# EAGLE design schematic (EAGLE 5.11)
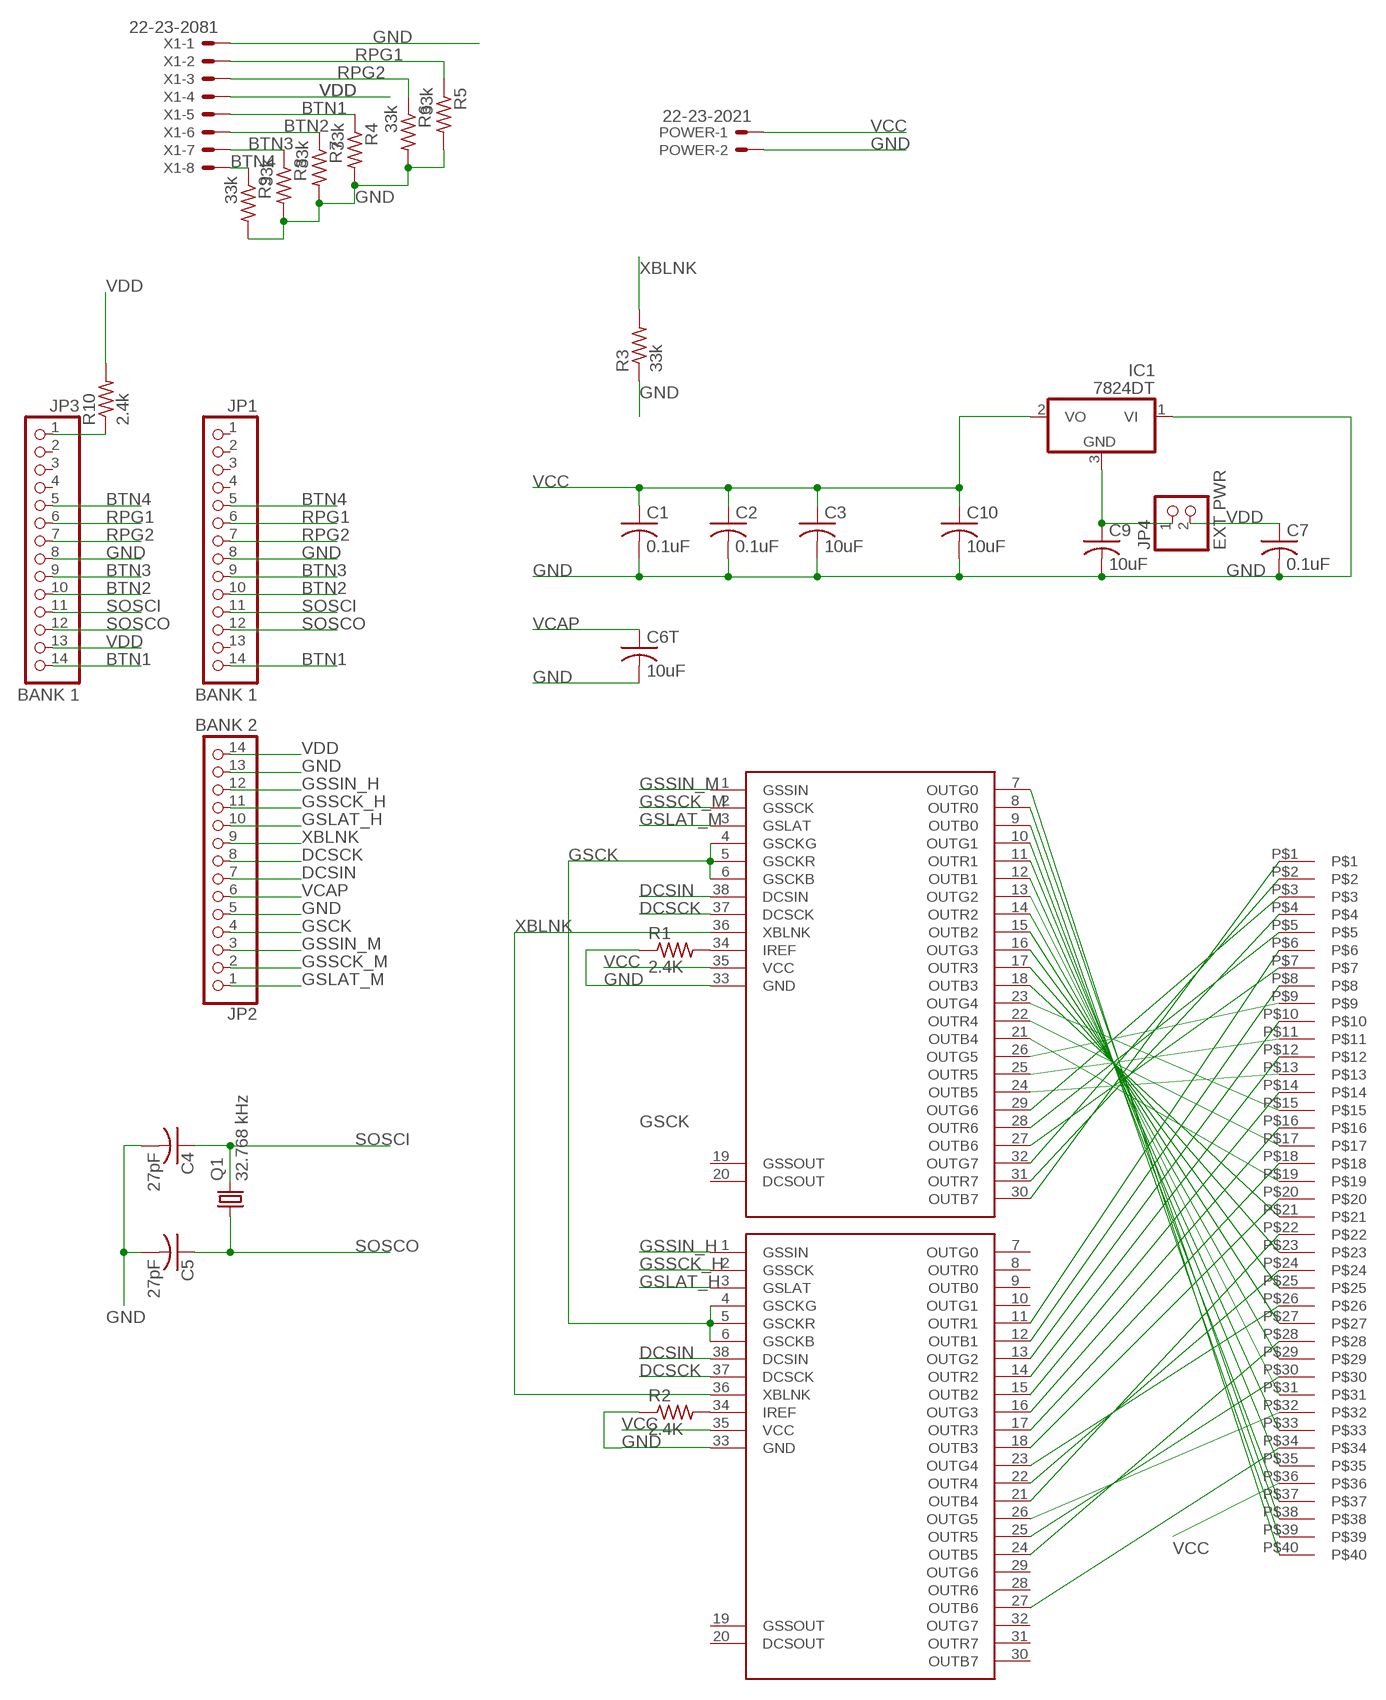
[diagram p0: schematic, sheet 1]

## Parts
C1  0.1uF  C-USC1206  [C1206]
C2  0.1uF  C-USC1206  [C1206]
C3  10uF  C-USC1206  [C1206]
C4  27pF  C-USC1206  [C1206]
C5  27pF  C-USC1206  [C1206]
C6T  10uF  C-USC1206  [C1206]
C7  0.1uF  C-USC1206  [C1206]
C9  10uF  C-USC1206  [C1206]
C10  10uF  C-USC1206  [C1206]
HOURS  TLC5951  [HTSSOP38DAP]
IC1  7824DT  [TO252]
JP1  BANK 1  PINHD-1X14  [1X14]
JP2  BANK 2  PINHD-1X14  [1X14]
JP3  BANK 1  PINHD-1X14  [1X14]
JP4  EXT PWR  PINHD-1X2  [1X02]
MINUTES  TLC5951  [HTSSOP38DAP]
POWER  22-23-2021  [22-23-2021]
Q1  32.768 kHz  CRYSTALTC26V  [TC26V]
R1  2.4K  R-US_R1206  [R1206]
R2  2.4K  R-US_R1206  [R1206]
R3  33k  R-US_R1206  [R1206]
R4  33k  R-US_R1206  [R1206]
R5  33k  R-US_R1206  [R1206]
R6  33k  R-US_R1206  [R1206]
R7  33k  R-US_R1206  [R1206]
R8  33k  R-US_R1206  [R1206]
R9  33k  R-US_R1206  [R1206]
R10  2.4k  R-US_R1206  [R1206]
U$3  501931-40  [501931-40]
X1  22-23-2081  [22-23-2081]

## Nets
BTN1: JP1.14 JP3.14 R4.1 X1.5
BTN2: JP1.10 JP3.10 R7.1 X1.6
BTN3: JP1.9 JP3.9 R8.1 X1.7
BTN4: JP1.5 JP3.5 R9.1 X1.8
DCSCK: HOURS.37(DCSCK) JP2.8 MINUTES.37(DCSCK)
DCSIN: HOURS.38(DCSIN) JP2.7 MINUTES.38(DCSIN)
GND: C1.2 C2.2 C3.2 C4.2 C5.2 C6T.2 C7.2 C9.2 C10.2 HOURS.33(GND) IC1.1(VI) JP1.8 JP2.5 JP2.13 JP3.8 MINUTES.33(GND) POWER.2 R1.1 R2.1 R3.1 R4.2 R5.2 R6.2 R7.2 R8.2 R9.2 X1.1
GSCK: HOURS.4(GSCKG) HOURS.5(GSCKR) HOURS.6(GSCKB) JP2.4 MINUTES.4(GSCKG) MINUTES.5(GSCKR) MINUTES.6(GSCKB)
GSLAT_H: HOURS.3(GSLAT) JP2.10
GSLAT_M: JP2.1 MINUTES.3(GSLAT)
GSSCK_H: HOURS.2(GSSCK) JP2.11
GSSCK_M: JP2.2 MINUTES.2(GSSCK)
GSSIN_H: HOURS.1(GSSIN) JP2.12
GSSIN_M: JP2.3 MINUTES.1(GSSIN)
N$1: MINUTES.32(OUTG7) U$3.P$2
N$2: MINUTES.31(OUTR7) U$3.P$4
N$3: MINUTES.30(OUTB7) U$3.P$1
N$4: MINUTES.29(OUTG6) U$3.P$3
N$5: MINUTES.28(OUTR6) U$3.P$5
N$6: MINUTES.27(OUTB6) U$3.P$7
N$7: MINUTES.26(OUTG5) U$3.P$9
N$8: MINUTES.25(OUTR5) U$3.P$11
N$9: MINUTES.24(OUTB5) U$3.P$13
N$10: MINUTES.23(OUTG4) U$3.P$15
N$11: MINUTES.22(OUTR4) U$3.P$17
N$12: MINUTES.21(OUTB4) U$3.P$19
N$13: MINUTES.18(OUTB3) U$3.P$21
N$14: MINUTES.17(OUTR3) U$3.P$23
N$15: MINUTES.16(OUTG3) U$3.P$25
N$16: MINUTES.15(OUTB2) U$3.P$27
N$17: MINUTES.14(OUTR2) U$3.P$29
N$18: MINUTES.13(OUTG2) U$3.P$31
N$19: MINUTES.12(OUTB1) U$3.P$33
N$20: MINUTES.11(OUTR1) U$3.P$35
N$21: MINUTES.10(OUTG1) U$3.P$37
N$22: MINUTES.9(OUTB0) U$3.P$39
N$23: MINUTES.7(OUTG0) U$3.P$40
N$24: MINUTES.8(OUTR0) U$3.P$38
N$25: HOURS.11(OUTR1) U$3.P$6
N$26: HOURS.12(OUTB1) U$3.P$8
N$27: HOURS.13(OUTG2) U$3.P$10
N$28: HOURS.14(OUTR2) U$3.P$12
N$29: HOURS.15(OUTB2) U$3.P$14
N$30: HOURS.16(OUTG3) U$3.P$16
N$31: HOURS.17(OUTR3) U$3.P$18
N$32: HOURS.18(OUTB3) U$3.P$20
N$33: HOURS.21(OUTB4) U$3.P$22
N$34: HOURS.22(OUTR4) U$3.P$24
N$35: HOURS.23(OUTG4) U$3.P$26
N$36: HOURS.26(OUTG5) U$3.P$32
N$37: HOURS.25(OUTR5) U$3.P$30
N$38: HOURS.24(OUTB5) U$3.P$28
N$39: HOURS.27(OUTB6) U$3.P$34
N$40: C9.1 IC1.3(GND) JP4.1
N$41: JP3.1 R10.1
N$42: MINUTES.34(IREF) R1.2
N$43: HOURS.34(IREF) R2.2
RPG1: JP1.6 JP3.6 R5.1 X1.2
RPG2: JP1.7 JP3.7 R6.1 X1.3
SOSCI: C4.1 JP1.11 JP3.11 Q1.2
SOSCO: C5.1 JP1.12 JP3.12 Q1.1
VCAP: C6T.1 JP2.6
VCC: C1.1 C2.1 C3.1 C10.1 HOURS.35(VCC) IC1.2(VO) MINUTES.35(VCC) POWER.1 U$3.P$36
VDD: C7.1 JP2.14 JP3.13 JP4.2 R10.2 X1.4
XBLNK: HOURS.36(XBLNK) JP2.9 MINUTES.36(XBLNK) R3.2
Unconnected: HOURS.7(OUTG0) HOURS.8(OUTR0) HOURS.9(OUTB0) HOURS.10(OUTG1) HOURS.19(GSSOUT) HOURS.20(DCSOUT) HOURS.28(OUTR6) HOURS.29(OUTG6) HOURS.30(OUTB7) HOURS.31(OUTR7) HOURS.32(OUTG7) JP1.1 JP1.2 JP1.3 JP1.4 JP1.13 JP3.2 JP3.3 JP3.4 MINUTES.19(GSSOUT) MINUTES.20(DCSOUT)

## Library data of the parts
C1-C5 C6T C7 C9 C10 = rcl:C-US: CAPACITOR, American symbol
HOURS MINUTES = texas:TLC5951: 24 Channel LED Driver 40 mA per channel
IC1 = linear:78*: Positive VOLTAGE REGULATOR Source: http://cache.national.com/ds/LM/LM78L05.pdf http://www.fairchildsemi.com/ds/LM/LM7805.pdf
JP1-JP3 = pinhead:PINHD-1X14: PIN HEADER
JP4 = pinhead:PINHD-1X2: PIN HEADER
POWER = con-molex:22-23-2021: .100" (2.54mm) Center Header - 2 Pin; MF: MOLEX; MPN: 22-23-2021; OC_FARNELL: 1462926; OC_NEWARK: 25C3832
Q1 = crystal:CRYSTAL: CRYSTAL; OC_FARNELL: unknown; OC_NEWARK: unknown
R1 R2 = resistor:R-US_: RESISTOR, American symbol
R3-R10 = rcl:R-US_: RESISTOR, American symbol
U$3 = con-molex:501931-40: Molex 40 pin connector Type 501931
X1 = con-molex:22-23-2081: .100" (2.54mm) Center Header - 8 Pin; MF: MOLEX; MPN: 22-23-2081; OC_FARNELL: 1756826; OC_NEWARK: 01C7592

## Board
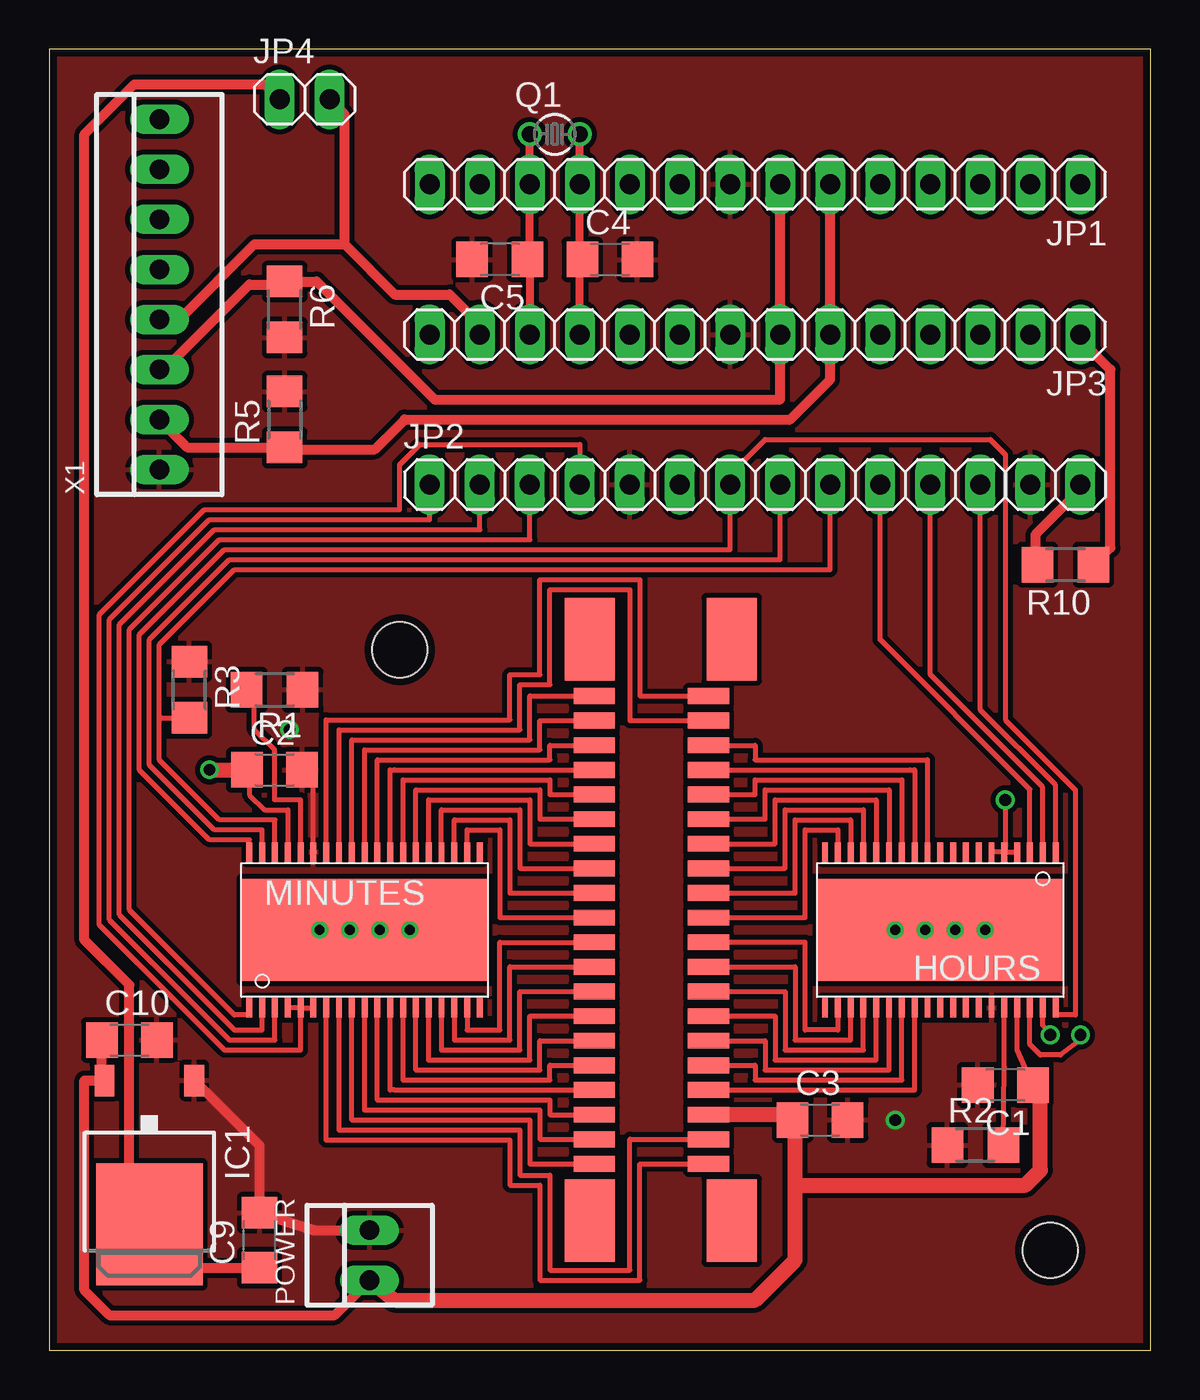
[diagram p1: board, top side]
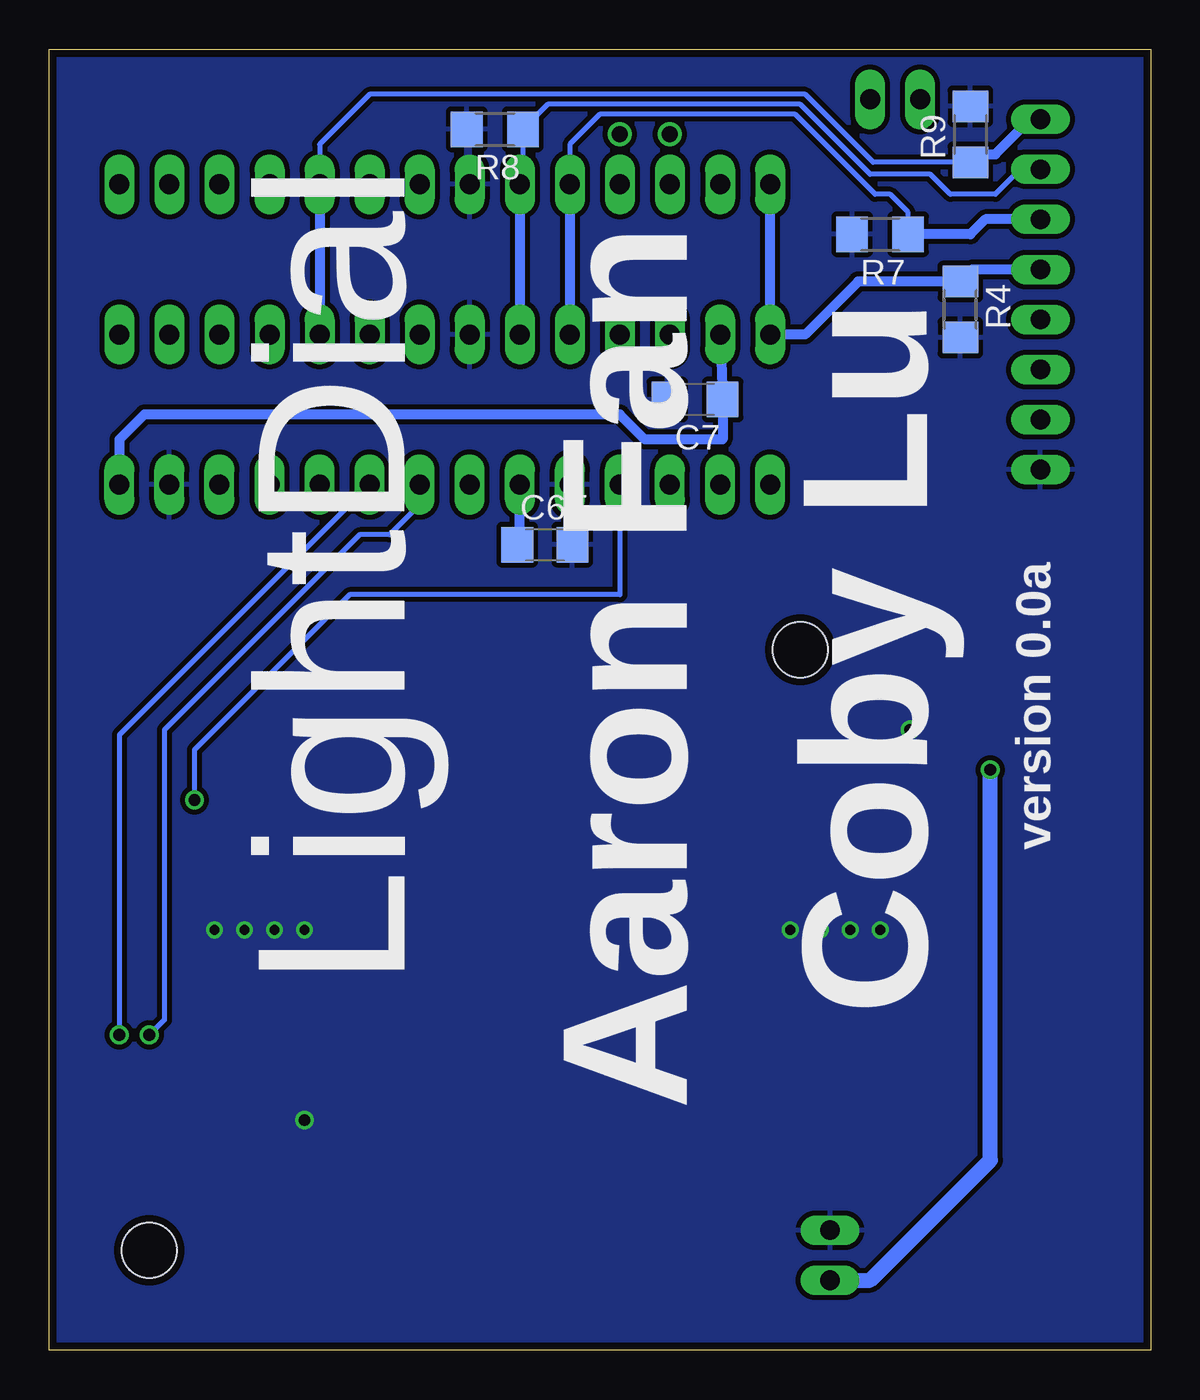
[diagram p2: board, bottom side, seen from below]

Size 55.88 x 66.04 mm. Coordinates in mm from the lower left corner, seen from the top.
Outline: 0,0 55.88,0 55.88,66.04 0,66.04 0,0
Copper layers (1*16): Top 0.0356mm / dielectric 1.5011mm / Bottom 0.0356mm
Design rules "LaenPCBOrder *": minimum track width 10mil, minimum drill 13mil, track to track 10mil, track to pad 10mil, pad to pad 10mil, via to via 10mil, smd to smd 10mil, copper to edge 15mil, drill to drill 10mil, minimum pad ring 7mil, minimum via ring 7mil, stop-mask expansion 4mil, vias tented up to drill 0mil, thermal gap 10mil
Holes 2.8 mm at 50.8,5.08 17.78,35.56

### Footprints (pad centres in the part's own frame; a part is rotated, then mirrored left to right if it is on the bottom)
C1206 = smd 1.6 x 1.8: 1 -1.4,0; 2 1.4,0
HTSSOP38DAP = smd 0.3 x 1: 1 -5.85,-3.95; 2 -5.2,-3.95; 3 -4.55,-3.95; 4 -3.9,-3.95; 5 -3.25,-3.95; 6 -2.6,-3.95; 7 -1.95,-3.95; 8 -1.3,-3.95; 9 -0.65,-3.95; 10 0,-3.95; 11 0.65,-3.95; 12 1.3,-3.95; 13 1.95,-3.95; 14 2.6,-3.95; 15 3.25,-3.95; 16 3.9,-3.95; 17 4.55,-3.95; 18 5.2,-3.95; 19 5.85,-3.95; 20 5.85,3.95; 21 5.2,3.95; 22 4.55,3.95; 23 3.9,3.95; 24 3.25,3.95; 25 2.6,3.95; 26 1.95,3.95; 27 1.3,3.95; 28 0.65,3.95; 29 0,3.95; 30 -0.65,3.95; 31 -1.3,3.95; 32 -1.95,3.95; 33 -2.6,3.95; 34 -3.25,3.95; 35 -3.9,3.95; 36 -4.55,3.95; 37 -5.2,3.95; 38 -5.85,3.95 | smd 12.5 x 5.2: EXP 0,0
TO252 = smd 1 x 1.6: 1 -2.28,-4.8; 2 2.28,-4.8 | smd 5.4 x 6.2: 3 0,2.5
1X14 = drill 1.016 long: 1 -16.51,0; 2 -13.97,0; 3 -11.43,0; 4 -8.89,0; 5 -6.35,0; 6 -3.81,0; 7 -1.27,0; 8 1.27,0; 9 3.81,0; 10 6.35,0; 11 8.89,0; 12 11.43,0; 13 13.97,0; 14 16.51,0
1X02 = drill 1.016 long: 1 -1.27,0; 2 1.27,0
22-23-2021 = drill 1 long: 1 -1.27,0; 2 1.27,0
TC26V = drill 0.813 round: 1 -1.27,0; 2 1.27,0
R1206 = smd 1.6 x 1.803: 1 -1.422,0; 2 1.422,0
501931-40 = smd 0.8 x 2.1: P$1 -11.875,-1.05; P$2 -11.875,4.75; P$3 -10.625,-1.05; P$4 -10.625,4.75; P$5 -9.375,-1.05; P$6 -9.375,4.75; P$7 -8.125,-1.05; P$8 -8.125,4.75; P$9 -6.875,-1.05; P$10 -6.875,4.75; P$11 -5.625,-1.05; P$12 -5.625,4.75; P$13 -4.375,-1.05; P$14 -4.375,4.75; P$15 -3.125,-1.05; P$16 -3.125,4.75; P$17 -1.875,-1.05; P$18 -1.875,4.75; P$19 -0.625,-1.05; P$20 -0.625,4.75; P$21 0.625,-1.05; P$22 0.625,4.75; P$23 1.875,-1.05; P$24 1.875,4.75; P$25 3.125,-1.05; P$26 3.125,4.75; P$27 4.375,-1.05; P$28 4.375,4.75; P$29 5.625,-1.05; P$30 5.625,4.75; P$31 6.875,-1.05; P$32 6.875,4.75; P$33 8.125,-1.05; P$34 8.125,4.75; P$35 9.375,-1.05; P$36 9.375,4.75; P$37 10.625,-1.05; P$38 10.625,4.75; P$39 11.875,-1.05; P$40 11.875,4.75 | smd 4.2 x 2.55: P$41 -14.75,-1.275; P$42 14.75,-1.275; P$43 -14.75,5.925; P$44 14.75,5.925
22-23-2081 = drill 1 long: 1 -8.89,0; 2 -6.35,0; 3 -3.81,0; 4 -1.27,0; 5 1.27,0; 6 3.81,0; 7 6.35,0; 8 8.89,0

### Placement (x,y rotation side)
C1  48.51,13.46 180 top
C2  11.43,29.46 0 top
C3  39.12,11.68 0 top
C4  28.45,55.37 0 top
C5  22.86,55.37 180 top
C6T  30.73,40.89 0 bottom
C7  23.11,48.26 180 bottom
C9  10.67,5.59 90 top
C10  4.06,15.75 0 top
HOURS  45.21,21.34 180 top
IC1  5.08,8.89 180 top
JP1  35.81,59.18 180 top
JP2  35.81,43.94 0 top
JP3  35.81,51.56 180 top
JP4  12.95,63.5 0 top
MINUTES  16,21.34 0 top
POWER  16.26,4.83 90 top
Q1  25.65,61.72 0 top
R1  11.43,33.53 180 top
R2  46.99,10.41 0 top
R3  7.11,33.53 270 top
R4  9.65,52.83 270 bottom
R5  11.94,47.24 90 top
R6  11.94,52.83 270 top
R7  13.72,56.64 180 bottom
R8  33.27,61.98 180 bottom
R9  9.14,61.72 90 bottom
R10  51.56,39.88 180 top
U$3  28.7,21.34 270 top
X1  5.59,53.59 90 top

### Tracks (layer width: path | path; a pad name or v marks a point on that pad's centre or on a via)
BTN1
  Bottom 0.254: 9.04,54.86 R4.1
  Bottom 0.508: JP1.14 JP3.14 17.53,51.56 14.83,54.25 R4.1 | X1.5 9.04,54.86
BTN2
  Bottom 0.254: JP1.10 29.46,61.21 27.94,62.74 18.03,62.74 13.97,58.67 13.21,58.67 12.29,57.76 R7.1
  Bottom 0.508: X1.6 8.38,57.4 9.14,56.64 R7.1 | JP1.10 JP3.10
BTN3
  Bottom 0.254: X1.7 6.6,59.94 7.87,58.67 10.16,58.67 11.18,59.69 14.22,59.69 17.78,63.25 30.58,63.25 R8.1 31.85,59.33 JP1.9
  Bottom 0.508: JP1.9 JP3.9
BTN4
  Bottom 0.254: 8.74,60.71 R9.1 14.07,60.3 17.53,63.75 39.62,63.75 42.16,61.21 JP1.5
  Bottom 0.508: JP1.5 JP3.5 | X1.8 6.1,62.48 7.87,60.71 8.74,60.71
DCSCK  (via drill 0.6)
  Top 0.254: MINUTES.37 10.8,26.42 8.38,26.42 5.08,29.72 5.08,36.07 9.14,40.13 37.08,40.13 JP2.8 | v50.8,16 50.41,16.51 HOURS.37
  Bottom 0.254: JP2.8 37.08,42.93 38.61,41.4 40.13,41.4 50.04,31.5 50.04,16.76 v50.8,16
DCSIN
  Top 0.254: MINUTES.38 10.15,25.65 10.16,25.91 8.13,25.91 4.57,29.46 4.57,36.32 8.89,40.64 34.54,40.64 JP2.7 34.54,44.45 36.32,46.23 47.75,46.23 48.51,45.47 48.51,32 52.07,28.45 52.07,17.02 51.06,17.02 HOURS.38
GND  (via drill 0.5, 0.6)
  Top 0.254: 12.19,33.53 R1.1 | R3.1 7.11,35.31 | 13.46,25.29 MINUTES.33 13.4,29.46 | 13.4,29.46 C2.2 | 13.4,29.46 13.46,29.46
  Top 0.508: POWER.2 13.46,6.1 C9.2 | C9.2 10.16,6.99 | C9.2 10.67,10.38 IC1.1 7.36,13.85 | R5.2 11.79,48.51
  other vias: 12.19,31.5 42.93,11.68 15.24,21.34 13.72,21.34 16.76,21.34 18.29,21.34 42.93,21.34 44.45,21.34 45.97,21.34 47.5,21.34
  pour Bottom: 0,0 0,66.04 55.88,66.04 55.88,0
  pour Top: 0,66.04 55.88,66.04 55.88,0 0,0
GSCK  (via drill 0.6)
  Top 0.254: MINUTES.5 12.75,15.24 8.89,15.24 2.54,21.59 2.54,37.34 7.87,42.67 17.78,42.67 17.78,44.96 18.8,45.97 26.92,45.97 JP2.4 | MINUTES.5 MINUTES.4 | MINUTES.5 MINUTES.6 | HOURS.5 HOURS.6 | HOURS.5 HOURS.4 | v48.51,27.94 48.51,25.34 HOURS.5
  Bottom 0.254: v48.51,27.94 48.51,30.48 40.64,38.35 26.92,38.35 JP2.4
GSLAT_H
  Top 0.254: HOURS.3 49.76,28.47 42.16,36.07 JP2.10
GSLAT_M
  Top 0.254: MINUTES.3 11.45,15.75 9.14,15.75 3.05,21.84 3.05,37.08 8.13,42.16 19.3,42.16 JP2.1
GSSCK_H
  Top 0.254: HOURS.2 50.41,28.58 44.7,34.29 JP2.11
GSSCK_M
  Top 0.254: MINUTES.2 10.8,16.26 9.4,16.26 3.56,22.1 3.56,36.83 8.38,41.66 21.84,41.66 JP2.2
GSSIN_H
  Top 0.254: HOURS.1 51.06,28.69 47.24,32.51 JP2.12
GSSIN_M
  Top 0.254: MINUTES.1 10.15,17.02 9.4,17.02 4.06,22.35 4.06,36.58 8.64,41.15 24.38,41.15 JP2.3
N$1
  Top 0.254: U$3.P$2 29.97,33.21 29.97,39.12 24.89,39.12 24.89,34.29 23.37,34.29 23.37,32 14.05,32 MINUTES.32
N$2
  Top 0.254: U$3.P$4 29.46,31.96 29.46,38.61 25.4,38.61 25.4,33.78 23.88,33.78 23.88,31.5 14.7,31.5 MINUTES.31
N$3
  Top 0.254: U$3.P$1 24.38,33.21 24.38,30.99 15.35,30.99 MINUTES.30
N$4
  Top 0.254: U$3.P$3 24.89,31.96 24.89,30.48 16,30.48 MINUTES.29
N$5
  Top 0.254: U$3.P$5 25.4,30.71 25.4,29.97 16.65,29.97 MINUTES.28
N$6
  Top 0.254: MINUTES.27 17.3,29.46 17.53,29.46 U$3.P$7
N$7
  Top 0.254: U$3.P$9 25.4,28.21 25.4,28.96 17.95,28.96 MINUTES.26
N$8
  Top 0.254: U$3.P$11 24.89,26.96 24.89,28.45 18.6,28.45 MINUTES.25
N$9
  Top 0.254: U$3.P$13 24.38,25.71 24.38,27.94 19.25,27.94 MINUTES.24
N$10
  Top 0.254: U$3.P$15 23.88,24.46 23.88,27.43 19.9,27.43 MINUTES.23
N$11
  Top 0.254: U$3.P$17 23.37,23.21 23.37,26.92 20.55,26.92 MINUTES.22
N$12
  Top 0.254: U$3.P$19 22.86,21.96 22.86,26.42 21.2,26.42 MINUTES.21
N$13
  Top 0.254: U$3.P$21 22.86,20.71 22.86,16.26 21.2,16.26 MINUTES.18
N$14
  Top 0.254: U$3.P$23 23.37,19.46 23.37,15.75 20.55,15.75 MINUTES.17
N$15
  Top 0.254: U$3.P$25 23.88,18.21 23.88,15.24 19.9,15.24 MINUTES.16
N$16
  Top 0.254: U$3.P$27 24.38,16.96 24.38,14.73 19.25,14.73 MINUTES.15
N$17
  Top 0.254: U$3.P$29 24.89,15.71 24.89,14.22 18.6,14.22 MINUTES.14
N$18
  Top 0.254: U$3.P$31 25.4,14.46 25.4,13.72 17.95,13.72 MINUTES.13
N$19
  Top 0.254: MINUTES.12 17.3,13.21 17.53,13.21 U$3.P$33
N$20
  Top 0.254: U$3.P$35 25.4,11.96 25.4,12.7 16.65,12.7 MINUTES.11
N$21
  Top 0.254: U$3.P$37 24.89,10.71 24.89,12.19 16,12.19 MINUTES.10
N$22
  Top 0.254: U$3.P$39 24.38,9.46 24.38,11.68 15.35,11.68 MINUTES.9
N$23
  Top 0.254: U$3.P$40 29.97,9.46 29.97,3.56 24.89,3.56 24.89,8.38 23.37,8.38 23.37,10.67 14.05,10.67 MINUTES.7
N$24
  Top 0.254: U$3.P$38 29.46,10.71 29.46,4.06 25.4,4.06 25.4,8.89 23.88,8.89 23.88,11.18 14.7,11.18 MINUTES.8
N$25
  Top 0.254: U$3.P$6 35.81,30.71 35.81,29.97 44.56,29.97 HOURS.11
N$26
  Top 0.254: HOURS.12 43.91,29.46 43.69,29.46 U$3.P$8
N$27
  Top 0.254: U$3.P$10 35.81,28.21 35.81,28.96 43.26,28.96 HOURS.13
N$28
  Top 0.254: U$3.P$12 36.32,26.96 36.32,28.45 42.61,28.45 HOURS.14
N$29
  Top 0.254: U$3.P$14 36.83,25.71 36.83,27.94 41.96,27.94 HOURS.15
N$30
  Top 0.254: U$3.P$16 37.34,24.46 37.34,27.43 41.31,27.43 HOURS.16
N$31
  Top 0.254: U$3.P$18 37.85,23.21 37.85,26.92 40.66,26.92 HOURS.17
N$32
  Top 0.254: U$3.P$20 38.35,21.96 38.35,26.42 40.01,26.42 HOURS.18
N$33
  Top 0.254: U$3.P$22 38.35,20.71 38.35,16.26 40.01,16.26 HOURS.21
N$34
  Top 0.254: U$3.P$24 37.85,19.46 37.85,15.75 40.66,15.75 HOURS.22
N$35
  Top 0.254: U$3.P$26 37.34,18.21 37.34,15.24 41.31,15.24 HOURS.23
N$36
  Top 0.254: U$3.P$32 35.81,14.46 35.81,13.72 43.26,13.72 HOURS.26
N$37
  Top 0.254: U$3.P$30 36.32,15.71 36.32,14.22 42.61,14.22 HOURS.25
N$38
  Top 0.254: U$3.P$28 36.83,16.96 36.83,14.73 41.96,14.73 HOURS.24
N$39
  Top 0.254: HOURS.27 43.91,13.21 43.69,13.21 U$3.P$34
N$40
  Top 0.508: C9.1 5.08,4.19 IC1.3 4.06,7.41 4.06,18.54 1.78,20.83 1.78,61.72 4.32,64.26 10.92,64.26 JP4.1
N$41
  Top 0.508: R10.1 53.85,40.74 53.85,49.78 52.32,51.31 JP3.1
N$42
  Top 0.254: R1.2 10.41,33.53 10.41,31.5 11.43,30.48 11.43,27.94 12.75,27.94 MINUTES.34
N$43
  Top 0.254: R2.2 48.46,14.38 HOURS.34
RPG1
  Top 0.508: JP1.6 JP3.6 39.62,49.28 37.59,47.24 18.03,47.24 16.51,45.72 12.04,45.72 R5.1 7.01,45.82 X1.2
RPG2
  Top 0.508: JP1.7 JP3.7 37.08,48.26 19.56,48.26 13.56,54.25 R6.1 11.79,54.1 10.16,54.1 5.84,49.78 X1.3
SOSCI
  Top 0.406: Q1.2 JP1.11 26.92,55.37 | 26.92,55.37 C4.1 | JP3.11 26.92,55.37
  Top 0.508: JP3.11 26.92,51.69
SOSCO
  Top 0.406: Q1.1 JP1.12 24.38,55.37 | C5.1 24.38,55.37 | 24.38,55.37 JP3.12
VCAP
  Bottom 0.508: C6T.1 32,40.89 JP2.6
VCC  (via drill 0.6)
  Top 0.254: 9.65,29.46 C2.1 10.16,29.33 10.16,28.19 10.92,27.43 12.1,27.43 MINUTES.35 | HOURS.35 49.11,15.24 C1.1 50.29,13.46 | 37.85,11.68 C3.1
  Top 0.508: POWER.1 14.48,1.78 3.05,1.78 1.78,3.05 1.78,13.69 IC1.2 2.8,14.11 2.66,14.24 C10.1
  Top 0.762: v8.13,29.46 C2.1 | U$3.P$36 37.44,11.96 C3.1 | 37.85,8.13 37.85,4.57 35.81,2.54 17.53,2.54 POWER.1 | 37.85,8.13 37.85,11.68 | 50.29,13.46 50.29,9.14 49.53,8.38 38.1,8.38 37.85,8.13
  Bottom 0.762: POWER.1 14.22,3.56 8.13,9.65 v8.13,29.46
VDD
  Top 0.508: JP3.13 21.84,52.07 20.32,53.59 17.53,53.59 14.99,56.13 | X1.4 6.6,52.32 10.41,56.13 14.99,56.13 | JP4.2 14.99,62.74 14.99,56.13 | JP2.14 52.32,43.69 50.04,41.4 50.04,39.98 R10.2
  Bottom 0.508: JP3.13 C7.1 21.71,46.23 25.65,46.23 26.92,47.5 51.05,47.5 52.32,46.23 JP2.14
XBLNK  (via drill 0.6)
  Top 0.254: JP2.9 39.62,39.62 9.4,39.62 5.59,35.81 5.59,32 | 5.59,32 5.59,29.97 8.64,26.92 11.45,26.92 MINUTES.36 | R3.2 5.69,32.11 5.59,32 | HOURS.36 49.76,15.52 50.29,14.99 51.31,14.99 52.32,15.75 v52.32,16
  Bottom 0.254: v52.32,16 52.32,31.24 JP2.9

### Text on the board
bPlace: LightDial | Aaron Fan | Coby Lu | version 0.0a